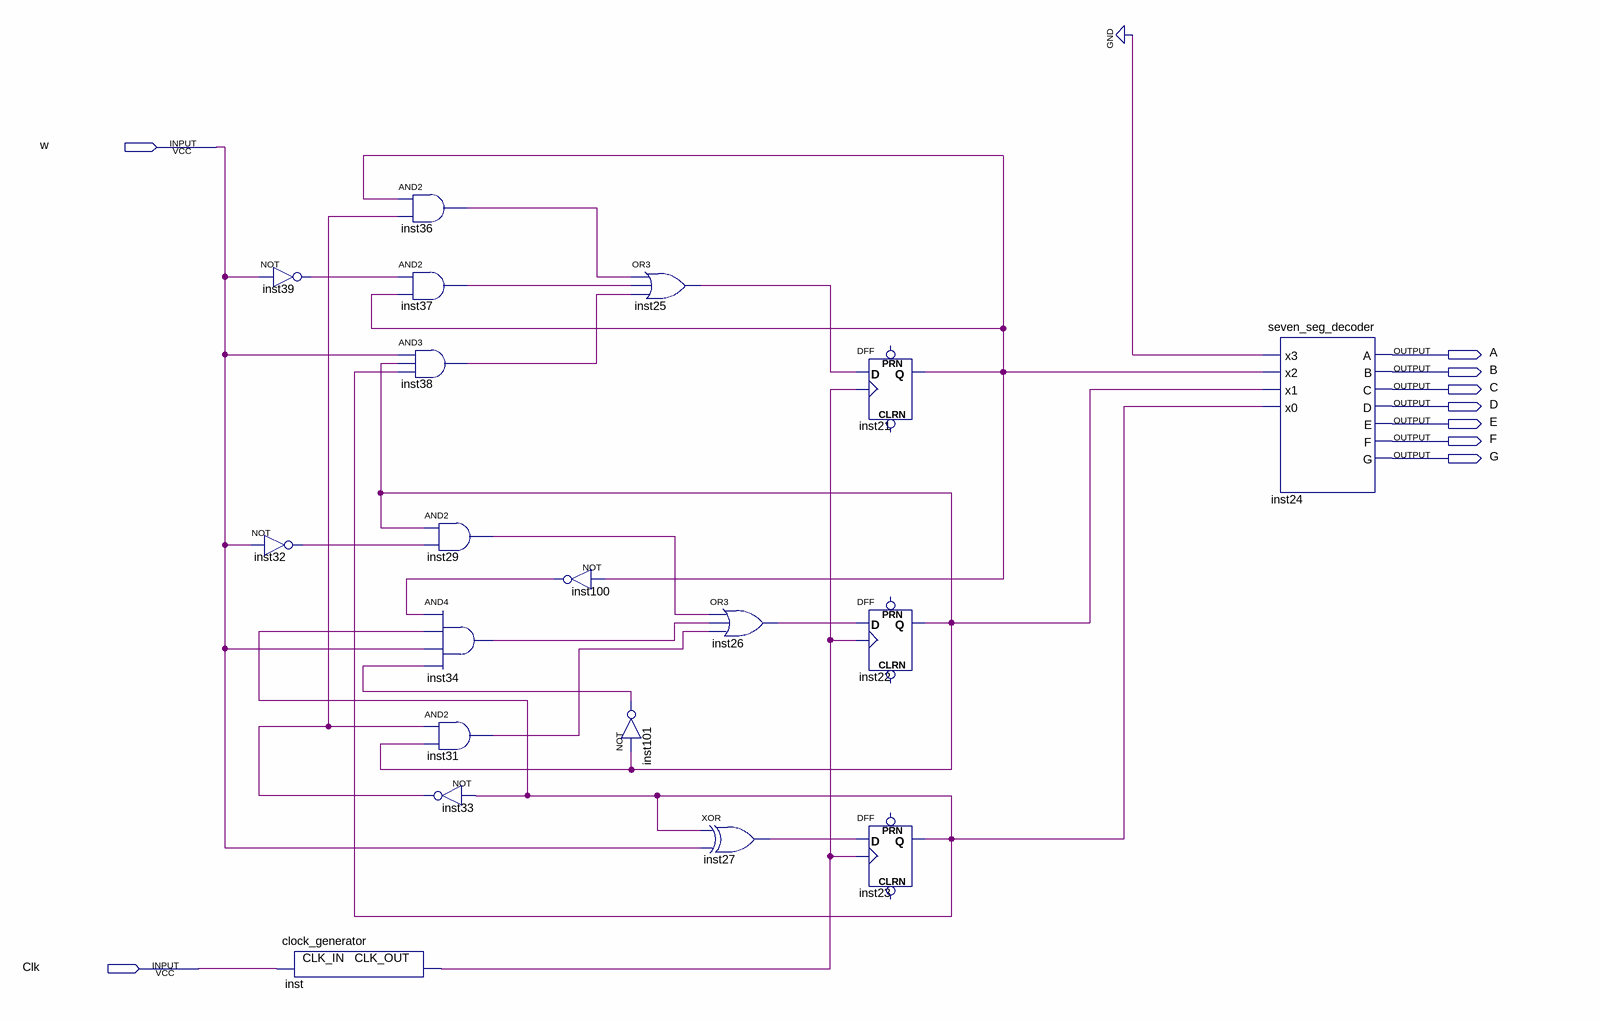
[diagram p0: schematic sheet]
// Quartus schematic lab11step1.bdf as structural Verilog: 19 symbols, 9 pins
module lab11step1 (
  input  w,
  input  Clk,
  output A,
  output B,
  output C,
  output D,
  output E,
  output F,
  output G
);

  wire inst21_q, inst22_q, inst23_q, inst25_out, inst26_out, inst27_out, inst29_out, inst31_out, inst32_out,
       inst33_out, inst34_out, inst36_out, inst37_out, inst38_out, inst39_out, inst100_out, inst101_out,
       inst_clk_out;

  not inst39 (inst39_out, w);
  not inst32 (inst32_out, w);
  clock_generator inst (.CLK_IN(Clk), .CLK_OUT(inst_clk_out));
  and inst36 (inst36_out, inst21_q, inst33_out);
  and inst37 (inst37_out, inst39_out, inst21_q);
  and inst38 (inst38_out, w, inst22_q, inst23_q);
  and inst29 (inst29_out, inst22_q, inst32_out);
  and inst34 (inst34_out, inst100_out, inst23_q, w, inst101_out);
  and inst31 (inst31_out, inst33_out, inst22_q);
  not inst33 (inst33_out, inst23_q);
  not inst100 (inst100_out, inst21_q);
  or inst25 (inst25_out, inst36_out, inst37_out, inst38_out);
  not inst101 (inst101_out, inst22_q);
  xor inst27 (inst27_out, inst23_q, w);
  or inst26 (inst26_out, inst29_out, inst34_out, inst31_out);
  DFF inst21 (.CLK(inst_clk_out), .D(inst25_out), .Q(inst21_q));  // open: CLRN, PRN
  DFF inst22 (.CLK(inst_clk_out), .D(inst26_out), .Q(inst22_q));  // open: CLRN, PRN
  DFF inst23 (.CLK(inst_clk_out), .D(inst27_out), .Q(inst23_q));  // open: CLRN, PRN
  seven_seg_decoder inst24 (
    .x3(1'b0), .x2(inst21_q), .x1(inst22_q), .x0(inst23_q), .A(A), .B(B), .C(C), .D(D), .E(E), .F(F), .G(G));
endmodule
